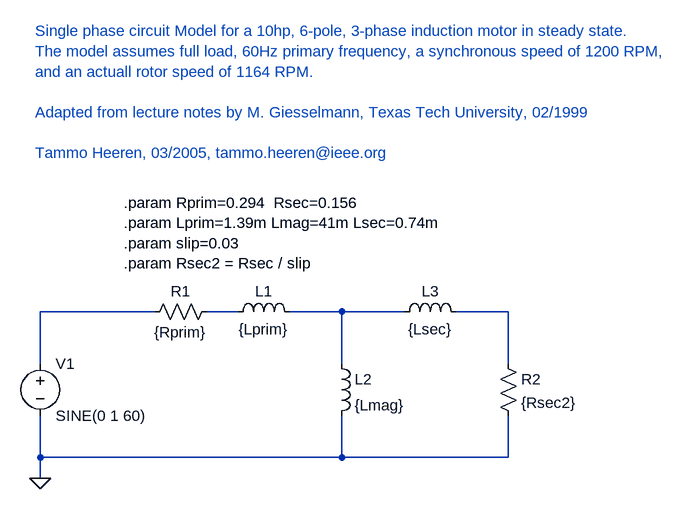
[diagram p0: schematic 10hpSinglePhaseSteadyState.asc]
10hpSinglePhaseSteadyState.asc, the LTspice schematic file:
Version 4
SHEET 1 1116 680
WIRE 32 288 32 208
WIRE 32 432 32 368
WIRE 32 464 32 432
WIRE 208 208 32 208
WIRE 336 208 288 208
WIRE 496 208 416 208
WIRE 496 288 496 208
WIRE 496 432 32 432
WIRE 496 432 496 368
WIRE 592 208 496 208
WIRE 752 208 672 208
WIRE 752 288 752 208
WIRE 752 432 496 432
WIRE 752 432 752 368
FLAG 32 464 0
SYMBOL res 192 224 R270
WINDOW 0 32 56 VTop 0
WINDOW 3 0 56 VBottom 0
SYMATTR InstName R1
SYMATTR Value {Rprim}
SYMBOL ind 320 224 R270
WINDOW 0 32 56 VTop 0
WINDOW 3 5 56 VBottom 0
SYMATTR InstName L1
SYMATTR Value {Lprim}
SYMBOL ind 480 272 R0
SYMATTR InstName L2
SYMATTR Value {Lmag}
SYMBOL ind 576 224 R270
WINDOW 0 32 56 VTop 0
WINDOW 3 5 56 VBottom 0
SYMATTR InstName L3
SYMATTR Value {Lsec}
SYMBOL res 736 272 R0
SYMATTR InstName R2
SYMATTR Value {Rsec2}
SYMBOL voltage 32 272 R0
WINDOW 123 0 0 Left 0
WINDOW 39 0 0 Left 0
SYMATTR InstName V1
SYMATTR Value SINE(0 1 60)
TEXT 160 40 Left 0 !.param Rprim=0.294  Rsec=0.156\n.param Lprim=1.39m Lmag=41m Lsec=0.74m\n.param slip=0.03\n.param Rsec2 = Rsec / slip
TEXT 24 -224 Left 0 ;Single phase circuit Model for a 10hp, 6-pole, 3-phase induction motor in steady state.\nThe model assumes full load, 60Hz primary frequency, a synchronous speed of 1200 RPM,\nand an actuall rotor speed of 1164 RPM.\n \nAdapted from lecture notes by M. Giesselmann, Texas Tech University, 02/1999\n \nTammo Heeren, 03/2005, tammo.heeren@ieee.org

The netlist it stands for:
* 10hpSinglePhaseSteadyState.asc
R1 N001 N002 {Rprim}
L1 N002 N003 {Lprim}
L2 N003 0 {Lmag}
L3 N003 N004 {Lsec}
R2 N004 0 {Rsec2}
V1 N001 0 SINE(0 1 60)
.param Rprim=0.294  Rsec=0.156
.param Lprim=1.39m Lmag=41m Lsec=0.74m
.param slip=0.03
.param Rsec2 = Rsec / slip
* Single phase circuit Model for a 10hp, 6-pole, 3-phase induction motor in steady state.
* The model assumes full load, 60Hz primary frequency, a synchronous speed of 1200 RPM,
* and an actuall rotor speed of 1164 RPM.
* Adapted from lecture notes by M. Giesselmann, Texas Tech University, 02/1999
* Tammo Heeren, 03/2005, tammo.heeren@ieee.org
.backanno
.end